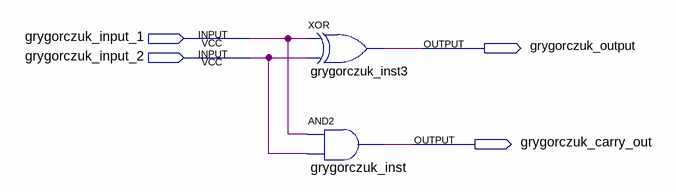
[diagram p0: schematic sheet]
// Quartus schematic HALF_WAVE_ADDER_GATES.bdf as structural Verilog: 2 symbols, 4 pins
module HALF_WAVE_ADDER_GATES (
  input  grygorczuk_input_1,
  input  grygorczuk_input_2,
  output grygorczuk_output,
  output grygorczuk_carry_out
);

  xor grygorczuk_inst3 (grygorczuk_output, grygorczuk_input_1, grygorczuk_input_2);
  and grygorczuk_inst (grygorczuk_carry_out, grygorczuk_input_1, grygorczuk_input_2);
endmodule
